# Altium schematic sheet DCI_TCAN.SchDoc
size 420 x 297 mm; ENG_APP_DATE: --/--/--; DSN_APP_DATE: --/--/--; CHK_APP_DATE: --/--/--
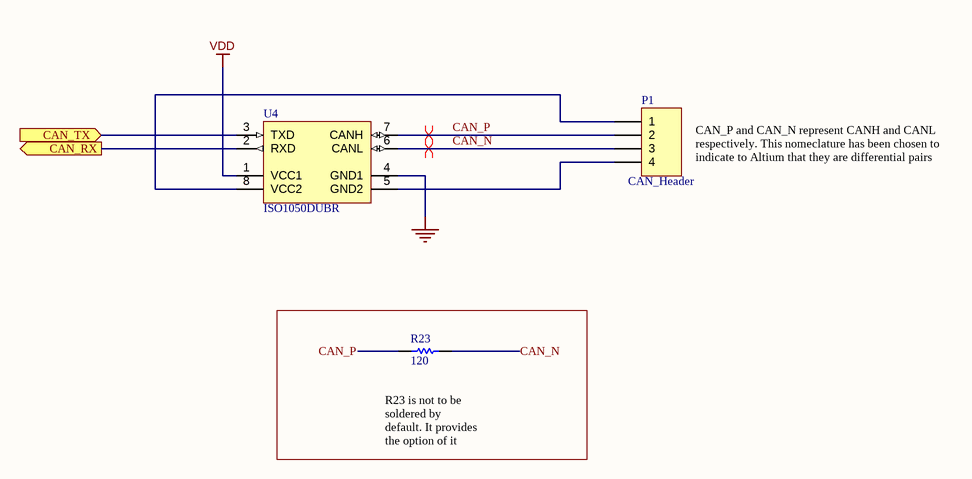
[diagram p0: DCI_TCAN.SchDoc]

## Parts
P1  CAN_Header  [HDR1X4]
R23  120  [0603R]
U4  ISO1050DUBR  [DUB0008A_L]

## Ports
CAN_RX (out), CAN_TX (in)

## Nets
GND: U4.4(GND1)
VDD: U4.1(VCC1)
CAN_N: P1.3 R23.1 U4.6(CANL)
CAN_P: P1.2 R23.2 U4.7(CANH)
CAN_RX: U4.2(RXD) ; port CAN_RX
CAN_TX: U4.3(TXD) ; port CAN_TX
NetP1_1: P1.1 U4.8(VCC2)
NetP1_4: P1.4 U4.5(GND2)

## Layout directives
differential pair: CAN_N, CAN_P

## Notes on the sheet
- CAN_P and CAN_N represent CANH and CANL respectively. This nomeclature has been chosen to indicate to Altium that they are differential pairs
- (near R23) R23 is not to be soldered by default. It provides the option of it being present to the final user. Therefore, only the footprint will be present in the final assembly
- MEMBERS:
- Universitat Politècnica de València
- - Gianmarco Leopoldo Sangoi
- - Vicente Beltrán Morte
- PROJECT:
- SIZE:
- FILE NAME:
- A3
- NUMBER:
- 5
- REVISION:
- A1
- DATE:
- 07/05/2022
- SHEET
- OF
- 7

## Library data of the parts
P1 = Header 4: Header, 4-Pin; LatestRevisionDate: 17-Jul-2002; LatestRevisionNote: Re-released for DXP Platform.; Publisher: Altium Limited
R23 = Res1: Resistor; Value: 1K; Ordered by: Subcon; Published: 8-Jun-2000; Revision: July-2002: Re-released for DXP Platform.; Publisher: Altium Limited
U4 = CMP-0315-00093-2: Isolated CAN Transceiver, -55 to 105 degC, 8-pin SOP (DUB), Green (RoHS & no Sb/Br); Manufacturer: Texas Instruments; Rating: Catalog; Isolated: Yes; Drivers Per Package: 1; PackageReference: DUB0008A; PartNumber: ISO1050DUBR; ComponentLink2Description: Package Specification; ComponentLink1Description: Datasheet; Mounting Technology: Surface Mount; ComponentLink1URL: http://www.ti.com/general/docs/lit/getliterature.tsp?genericPartNumber=ISO1050&fileType=pdf; ComponentLink2URL: http://www.ti.com/litv/pdf/mpds247b; Eco-Plan: Green (RoHS & no Sb/Br); PackageDescription: 8-Pin Small Outline Package 2.54 mm Pitch; PackageVersion: revC, May-2006; SubFamily: CAN; DatasheetVersion: SLLS983E